# EasyEDA Pro project ProPrj_智能门禁_2025-03-14.epro

# Schematic Schematic1
Board Name: Board1; Create Date: 2025-03-06; Page Name: P1; Project Name: 智能门禁; Schematic Name: Schematic1; Update Date: 2025-03-06; Company: 嘉立创EDA; Page Size: A4; Version: V1.0
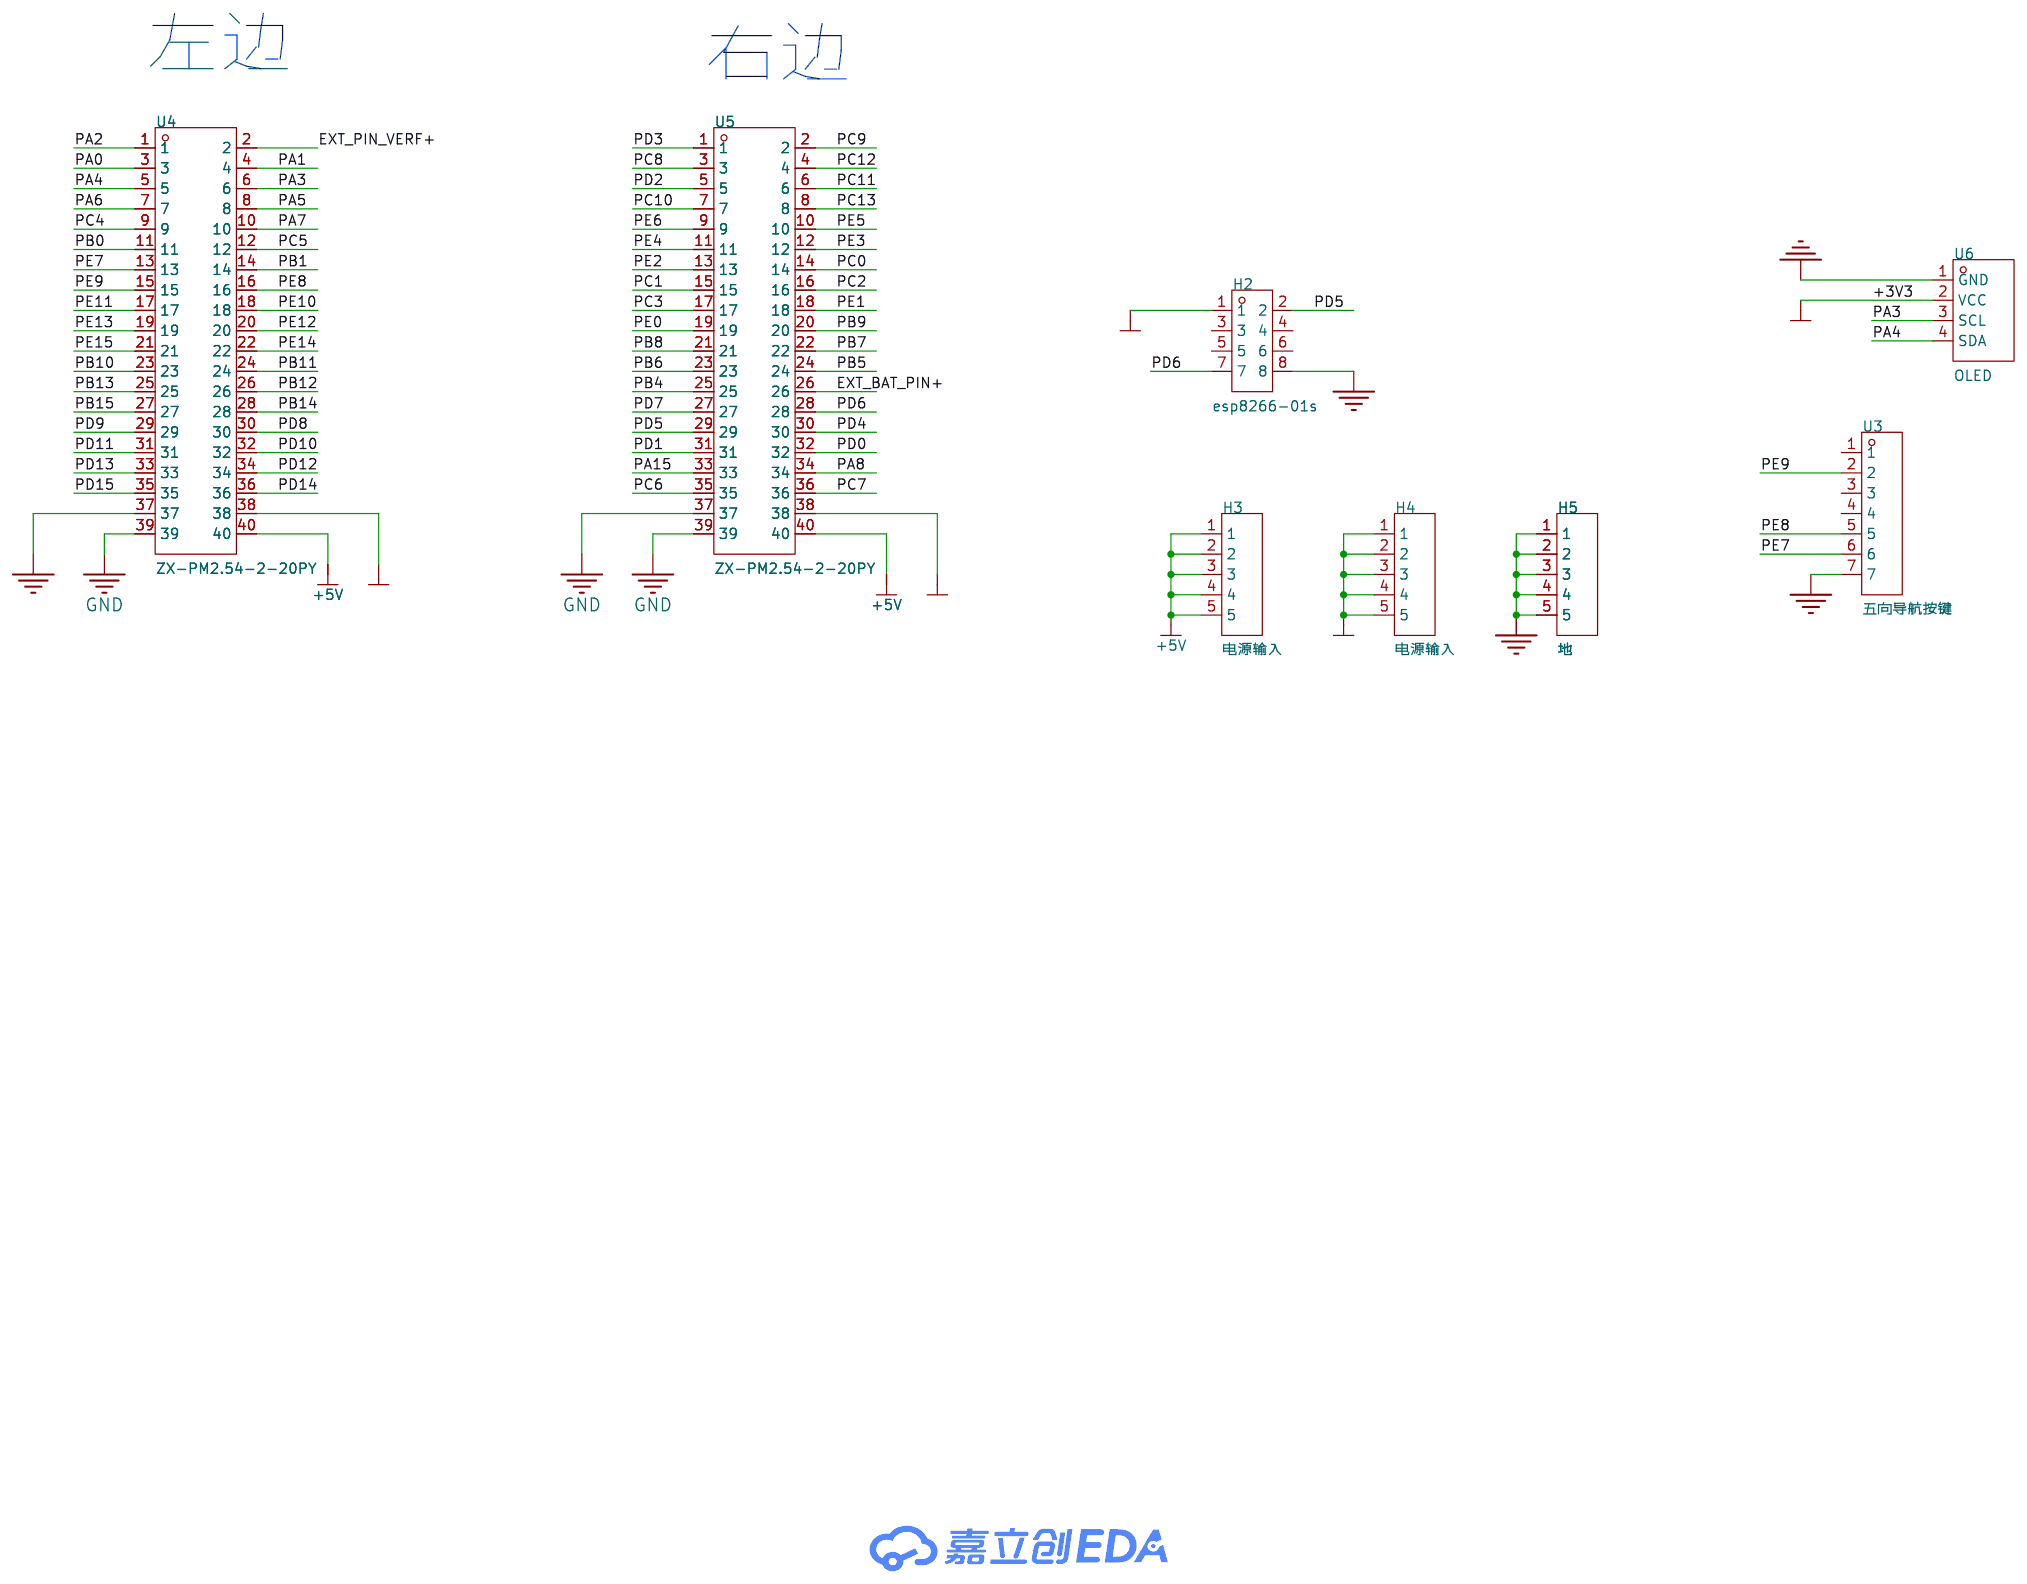
[diagram p0: schematic sheet]

## Parts
H2  esp8266-01s  [HDR-TH_8P-P2.54-V-F-R2-C4-S2.54]
H3  电源输入  [HDR-TH_5P-P2.54-V-M]
H4  电源输入  [HDR-TH_5P-P2.54-V-M]
H5  地  [HDR-TH_5P-P2.54-V-M]
U3  五向导航按键  [HDR-TH_7P-P2.54-H-F-W10.0-N]
U4  ZX-PM2.54-2-20PY  [HDR-TH_40P-P2.54-V-F-R2-C20-S2.54]
U5  ZX-PM2.54-2-20PY  [HDR-TH_40P-P2.54-V-F-R2-C20-S2.54]
U6  OLED  [OLED-TH_L27.8-W27.2-P2.54_C9900033791]

## Library data of the parts
H2 = PM254V-12-08-H85: 插孔结构:2x4P;间距:2.54mm;行距:2.54mm;圆孔/方孔:方孔;安装类型:直插;排数:双排;总孔位数:8P;额定电流:3A;额定电压:250V;插孔方向:顶部;塑高:8.5mm;工作温度范围:-40℃~+105℃;; LCSC Part Name: 间距:2.54mm 2x4P 直插; Supplier Part: C2834799; Manufacturer: XFCN(兴飞); Supplier Footprint: 插件,P=2.54mm; JLCPCB Part Class: 扩展库; Datasheet: https://atta.szlcsc.com/upload/public/pdf/source/20200309/C492399_8C441E2934FBB604A89B37A68AA45ECF.pdf; Supplier: LCSC; Holes Structure: 2x4P; Pitch: 2.54mm; Row Spacing: 2.54mm; Circular Hole / Square Hole: 方孔; Mounting Type: 直插; Number of Rows: 双排; Number of Holes: 8P; Current Rating (Max): 3A; Voltage Rating (Max): 250V; Holes Direction: 顶部; Insulation Height: 8.5mm; Operating Temperature Range: -40℃~+105℃
H3-H5 = PZ254V-11-05P: 插针结构:1x5P;间距:2.54mm;行距:-;圆针/方针:方针;安装方式:直插;排数:单排;总PIN位数:5P;额定电流:-;额定电压:-;配合针长度:6mm;塑高:2.5mm;端接针长度:3mm;触头材质:黄铜;触头镀层:-;工作温度:-40℃~+105℃;颜色:黑色;; LCSC Part Name: 1x5P 间距:2.54mm 方针 直插; Supplier Part: C492404; Manufacturer: XFCN(兴飞); Supplier Footprint: 插件,P=2.54mm; JLCPCB Part Class: 扩展库; Datasheet: https://atta.szlcsc.com/upload/public/pdf/source/20200309/C492404_E51533260F8710EFF5D4617281164C1D.pdf; Supplier: LCSC; Pin Structure: 1x5P; Pitch: 2.54mm; Circluar Pins/Square Pins: 方针; Mounting Type: 直插; Number of Rows: 单排; Number of Pins: 5P; Length of Mating Pin: 6mm; Insulation Height: 2.5mm; Length of End Connection Pin: 3mm; Contact Material: 黄铜; Operating Temperature: -40℃~+105℃; Color: 黑色
U3 = PM254-1-07-W-8.5: 插孔结构:1x7P;间距:2.54mm;行距:-;圆孔/方孔:方孔;安装类型:弯插;排数:单排;总孔位数:7P;额定电流:3A;额定电压:-;插孔方向:侧面;塑高:8.5mm;触头材质:铜合金;工作温度范围:-40℃~+105℃;焊接温度(最大值):260℃@5S;; LCSC Part Name: 1x7P 间距:2.54mm 弯插; Supplier Part: C2897389; Manufacturer: HCTL(华灿天禄); Supplier Footprint: 弯插,P=2.54mm; JLCPCB Part Class: 扩展库; Datasheet: https://atta.szlcsc.com/upload/public/pdf/source/20230609/7BA40A3D721268A082DCDEAD4C99131B.pdf; Supplier: LCSC; Holes Structure: 1x7P; Pitch: 2.54mm; Circular Hole / Square Hole: 方孔; Mounting Type: 弯插; Number of Rows: 单排; Number of Holes: 7P; Current Rating (Max): 3A; Holes Direction: 侧面; Insulation Height: 8.5mm; Contact Material: 铜合金; Operating Temperature Range: -40℃~+105℃; Soldering Temperature(Max): 260℃@5S
U4 U5 = ZX-PM2.54-2-20PY: 插孔结构:2x20P;间距:2.54mm;行距:2.54mm;圆孔/方孔:方孔;安装类型:直插;排数:双排;总孔位数:40P;额定电流:-;额定电压:1kV;插孔方向:顶部;塑高:8.5mm;触头材质:-;触头镀层:金;工作温度范围:-40℃~+105℃;焊接温度(最大值):260℃@5S;; LCSC Part Name: 2x20P 间距:2.54mm 直插; Supplier Part: C7499354; Manufacturer: Megastar(兆星); Supplier Footprint: 插件,P=2.54mm; JLCPCB Part Class: 扩展库; Datasheet: https://atta.szlcsc.com/upload/public/pdf/source/20231122/9B6D473472B386A28F854AA43527D8FA.pdf; Supplier: LCSC; Holes Structure: 2x20P; Pitch: 2.54mm; Row Spacing: 2.54mm; Circular Hole / Square Hole: 方孔; Mounting Type: 直插; Number of Rows: 双排; Number of Holes: 40P; Voltage Rating (Max): 1kV; Holes Direction: 顶部; Insulation Height: 8.5mm; Contact Plating: 金; Operating Temperature Range: -40℃~+105℃; Soldering Temperature(Max): 260℃@5S
U6 = HS96L03W2C03: 主控芯片:SSD1315;接口类型:I2C;尺寸(inch):0.96;像素分辨率:128x64;; LCSC Part Name: 0.96寸OLED显示屏窄白光IIC; Supplier Part: C5248080; Manufacturer: HS(汉昇); JLCPCB Part Class: 扩展库; Datasheet: https://atta.szlcsc.com/upload/public/pdf/source/20230627/763D01F79A90007632F098068C7C8AD9.pdf; Supplier: LCSC; Main Control Chip: SSD1315; Interface Type: I2C; Size: 0.96; Pixel Resolution: 128x64; Operating Temperature: -40℃~+70℃

## Nets
+3V3: H2.1 H4.1 H4.2 H4.3 H4.4 H4.5 U4.38 U5.38 U6.2(VCC)
+5V: H3.1 H3.2 H3.3 H3.4 H3.5 U4.40 U5.40
AGND: U4.37
GND: H2.8 H5.1 H5.2 H5.3 H5.4 H5.5 U3.7 U4.39 U5.37 U5.39 U6.1(GND)
EXT_BAT_PIN+: U5.26
EXT_PIN_VERF+: U4.2
PA0: U4.3
PA1: U4.4
PA2: U4.1
PA3: U4.6 U6.3(SCL)
PA4: U4.5 U6.4(SDA)
PA5: U4.8
PA6: U4.7
PA7: U4.10
PA8: U5.34
PA15: U5.33
PB0: U4.11
PB1: U4.14
PB4: U5.25
PB5: U5.24
PB6: U5.23
PB7: U5.22
PB8: U5.21
PB9: U5.20
PB10: U4.23
PB11: U4.24
PB12: U4.26
PB13: U4.25
PB14: U4.28
PB15: U4.27
PC0: U5.14
PC1: U5.15
PC2: U5.16
PC3: U5.17
PC4: U4.9
PC5: U4.12
PC6: U5.35
PC7: U5.36
PC8: U5.3
PC9: U5.2
PC10: U5.7
PC11: U5.6
PC12: U5.4
PC13: U5.8
PD0: U5.32
PD1: U5.31
PD2: U5.5
PD3: U5.1
PD4: U5.30
PD5: H2.2 U5.29
PD6: H2.7 U5.28
PD7: U5.27
PD8: U4.30
PD9: U4.29
PD10: U4.32
PD11: U4.31
PD12: U4.34
PD13: U4.33
PD14: U4.36
PD15: U4.35
PE0: U5.19
PE1: U5.18
PE2: U5.13
PE3: U5.12
PE4: U5.11
PE5: U5.10
PE6: U5.9
PE7: U3.6 U4.13
PE8: U3.5 U4.16
PE9: U3.2 U4.15
PE10: U4.18
PE11: U4.17
PE12: U4.20
PE13: U4.19
PE14: U4.22
PE15: U4.21

Not connected (* = marked no-connect by the designer): H2 3 4 5 6; U3 1 3 4

## Notes on the sheet
- 左边
- 右边

# Board PCB1
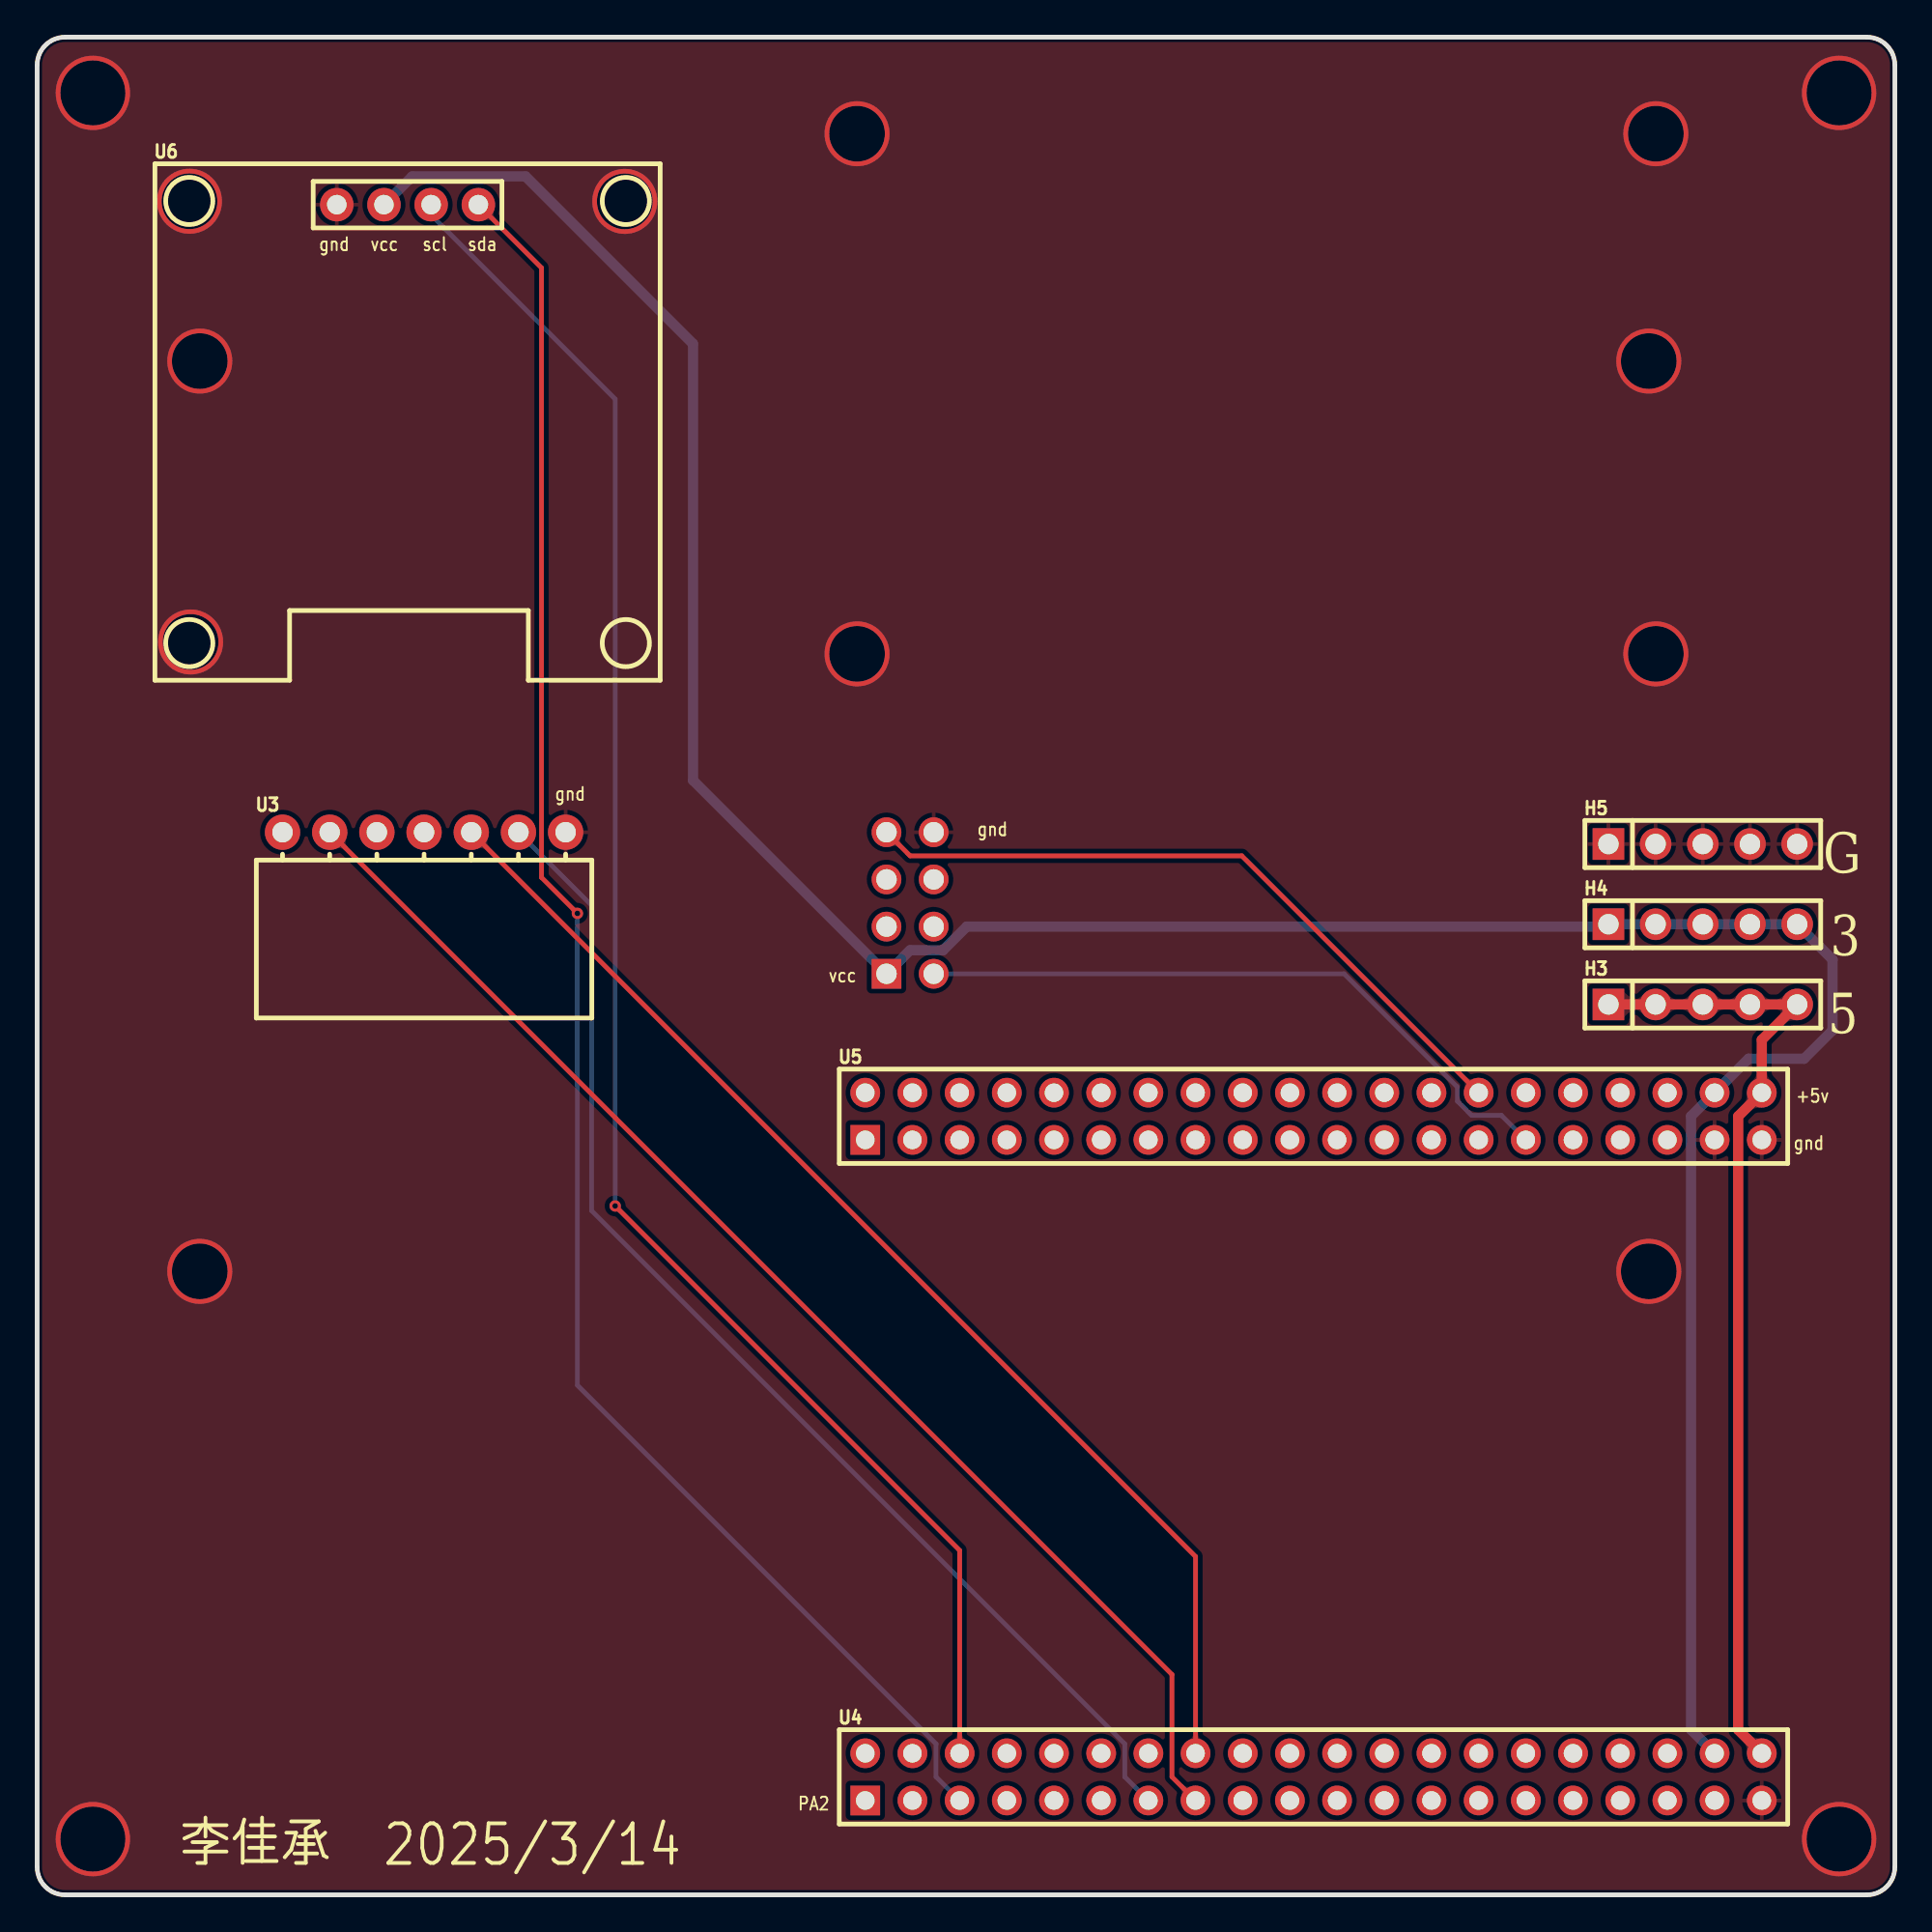
[diagram p1: board, top side]
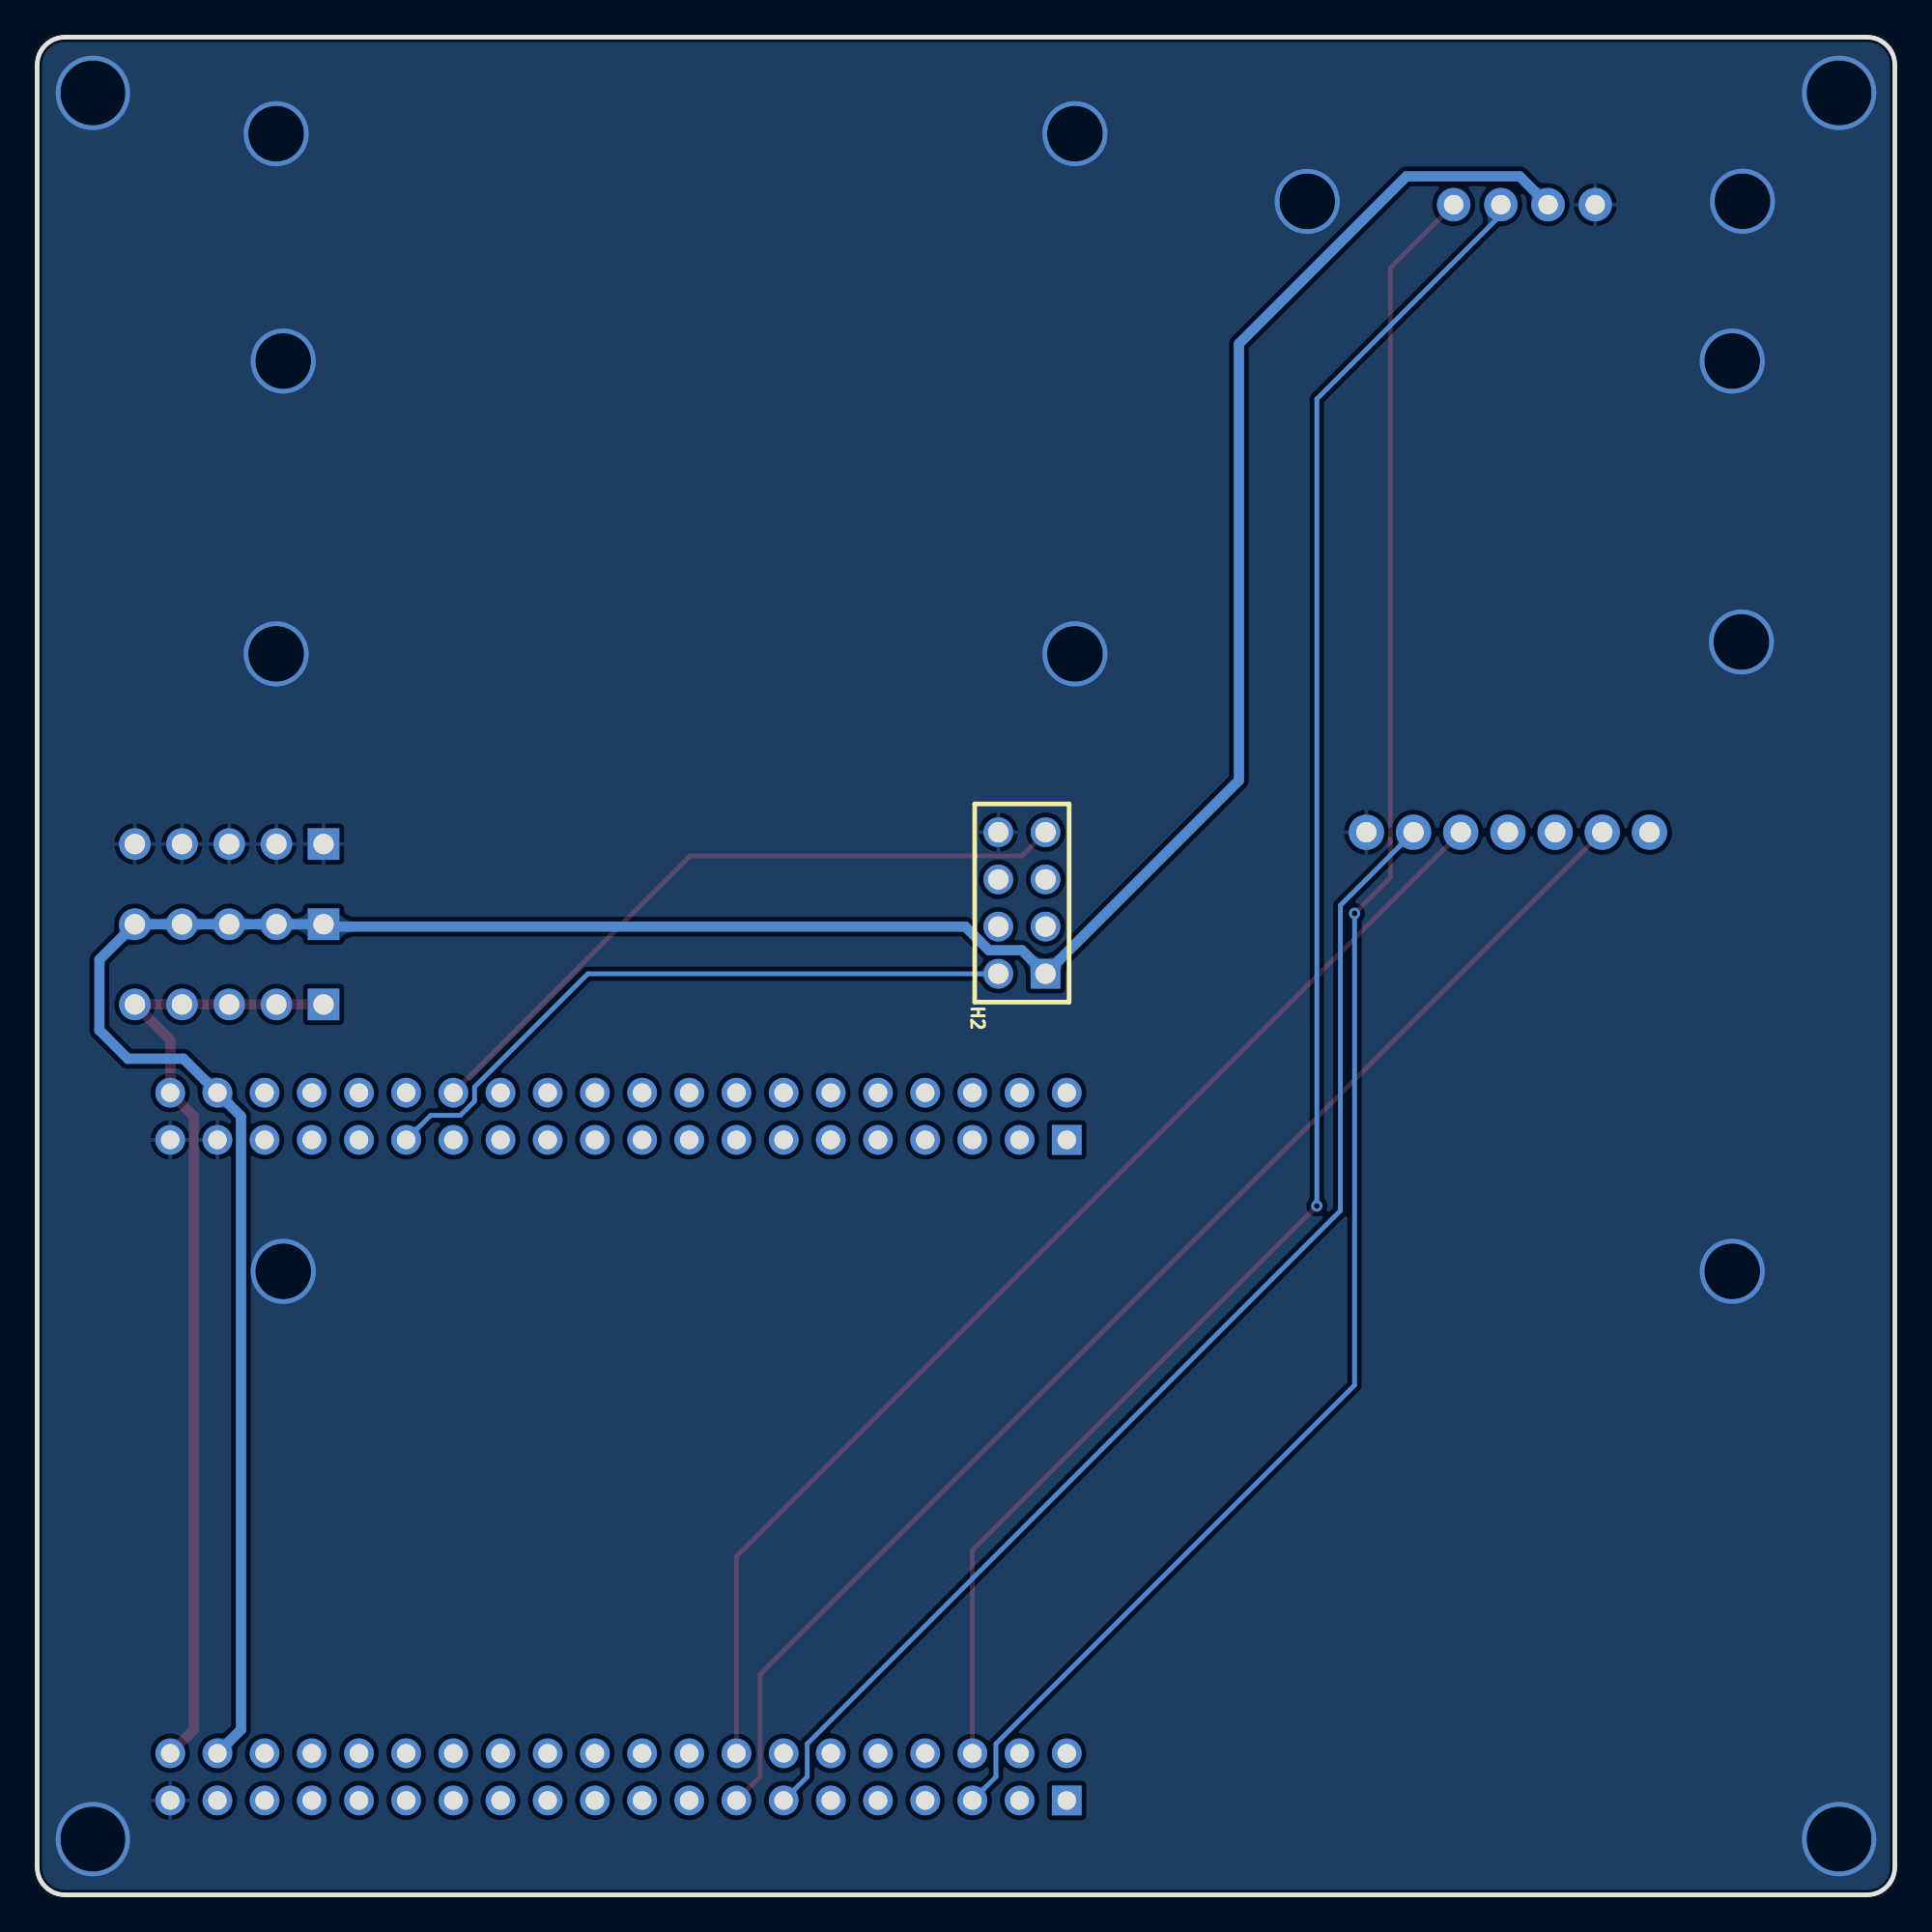
[diagram p2: board, bottom side, seen from below]

Outline 100 x 100 mm; copper layers: Top Layer, Bottom Layer. Coordinates in mm from the lower left corner of the outline.
Outline path: 0,98.5 0,1.5 arc(0.44,0.44) 1.5,0 98.5,0 arc(99.56,0.44) 100,1.5 100,98.5 arc(99.56,99.56) 98.5,100 1.5,100 arc(0.44,99.56) 0,98.5
Stack: Top Layer 0.035mm / Dielectric1 1.51mm FR4 er 4.5 / Bottom Layer 0.035mm

## Design rules (mm)
template: JLCPCB Capability(Two Layers Board)
spacing copperThickness1oz (default): track to track 0.102, other pairs 0.152 to 0.3
spacing copperThickness2oz: track to track 0.203, other pairs 0.152 to 0.3
track width copperThickness1oz (default): min 0.127, default 0.254, max 2.54
track width copperThickness2oz: min 0.203, default 0.254, max 2.54
differential pair differentialPair (default): width min 0.127, default 0.254, max 2.54; gap min 0.152, default 0.152
via viaSize (default): diameter min 0.5, default 0.61, max 10; hole min 0.3, default 0.305, max 6.3

## Placement (name value [footprint] x y rotation side)
H2  esp8266-01s  [HDR-TH_8P-P2.54-V-F-R2-C4-S2.54]  46.99 53.39 90 bottom
H3  电源输入  [HDR-TH_5P-P2.54-V-M]  89.66 47.93 0 top
H4  电源输入  [HDR-TH_5P-P2.54-V-M]  89.66 52.25 0 top
H5  地  [HDR-TH_5P-P2.54-V-M]  89.66 56.57 0 top
U3  五向导航按键  [HDR-TH_7P-P2.54-H-F-W10.0-N]  20.83 57.2 0 top
U4  ZX-PM2.54-2-20PY  [HDR-TH_40P-P2.54-V-F-R2-C20-S2.54]  68.71 6.35 0 top
U5  ZX-PM2.54-2-20PY  [HDR-TH_40P-P2.54-V-F-R2-C20-S2.54]  68.71 41.91 0 top
U6  OLED  [OLED-TH_L27.8-W27.2-P2.54_C9900033791]  19.94 90.98 0 top

## Footprints (pads in the part's own frame, mm; a bottom-side part is the same pattern mirrored in y, then rotated)
HDR-TH_5P-P2.54-V-M
  rect 1.7x1.7 hole 1.1: 1(-5.08,0)
  round 1.7 hole 1.1: 2(-2.54,0) 3(0,0) 4(2.54,0) 5(5.08,0)
HDR-TH_7P-P2.54-H-F-W10.0-N
  round 1.9 hole 1.1: 1(-7.62,0) 2(-5.08,0) 3(-2.54,0) 4(0,0) 5(2.54,0) 6(5.08,0) 7(7.62,0)
HDR-TH_8P-P2.54-V-F-R2-C4-S2.54
  rect 1.6x1.6 hole 1.1: 1(-3.81,-1.27)
  round 1.6 hole 1.1: 2(-3.81,1.27) 3(-1.27,-1.27) 4(-1.27,1.27) 5(1.27,-1.27) 6(1.27,1.27) 7(3.81,-1.27) 8(3.81,1.27)
HDR-TH_40P-P2.54-V-F-R2-C20-S2.54
  rect 1.6x1.6 hole 1: 1(-24.13,-1.27)
  round 1.6 hole 1: 2(-24.13,1.27) 3(-21.59,-1.27) 4(-21.59,1.27) 5(-19.05,-1.27) 6(-19.05,1.27) 7(-16.51,-1.27) 8(-16.51,1.27) 9(-13.97,-1.27) 10(-13.97,1.27) 11(-11.43,-1.27) 12(-11.43,1.27) 13(-8.89,-1.27) 14(-8.89,1.27) 15(-6.35,-1.27) 16(-6.35,1.27) 17(-3.81,-1.27) 18(-3.81,1.27) 19(-1.27,-1.27) 20(-1.27,1.27) 21(1.27,-1.27) 22(1.27,1.27) 23(3.81,-1.27) 24(3.81,1.27) 25(6.35,-1.27) 26(6.35,1.27) 27(8.89,-1.27) 28(8.89,1.27) 29(11.43,-1.27) 30(11.43,1.27) 31(13.97,-1.27) 32(13.97,1.27) 33(16.51,-1.27) 34(16.51,1.27) 35(19.05,-1.27) 36(19.05,1.27) 37(21.59,-1.27) 38(21.59,1.27) 39(24.13,-1.27) 40(24.13,1.27)
OLED-TH_L27.8-W27.2-P2.54_C9900033791
  round 1.8 hole 1.05: 1(-3.81,0) 2(-1.27,0) 3(1.27,0) 4(3.81,0)

## Nets
As in the schematic.

Pads without a net: H2 3 4 5 6; U3 1 3 4

## Via types
v1: diameter 3.5, hole 3, Top Layer to Bottom Layer, 11 vias
v2: diameter 4, hole 3.5, Top Layer to Bottom Layer, 4 vias
v3: diameter 0.61, hole 0.305, Top Layer to Bottom Layer, 2 vias

## Routing (per net, layer and track width the routed paths; a pad name or vN(x,y) marks a point on that pad's centre or on a via; arc(x,y) is an arc through that point)
+3V3: length 160.2
  Bottom Layer w0.55: U4.38 89.03,8.89 89.03,41.91 U5.38 92.13,45.01 95.12,45.01 96.65,46.54 96.65,50.34 H4.5 H4.4 H4.3 H4.2 H4.1 84.46,52.12 50.04,52.12 48.77,50.85 46.99,50.85 H2.1 35.31,60 35.31,83.49 26.29,92.51 20.19,92.51 U6.2
+5V: length 52.3
  Top Layer w0.55: H3.1 H3.2 H3.3 H3.4 H3.5 92.84,46.03 U5.40 91.57,41.91 91.57,8.89 U4.40
GND:
  vias: v1(8.2,91.17) v1(8.26,67.44) v1(8.75,82.56) v1(8.75,33.56) v1(31.63,91.16) v1(44.13,94.8) v1(44.13,66.8) v1(86.75,82.56) v1(86.75,33.56) v1(87.13,94.8) v1(87.13,66.8) v2(3,97) v2(3,3) v2(97,97) v2(97,3)
PA3: length 95.1
  Top Layer w0.254: v3(31.12,37.08) 49.66,18.54 U4.6
  Bottom Layer w0.254: U6.3 21.21,90.42 31.12,80.52 v3(31.12,37.08)
PA4: length 96.6
  Top Layer w0.254: v3(29.08,52.83) 27.15,54.76 27.15,87.58 U6.4
  Bottom Layer w0.254: v3(29.08,52.83) 29.08,27.43 48.39,8.13 48.39,6.35 U4.5
PD5: length 36
  Bottom Layer w0.254: H2.2 70.36,49.58 76.45,43.48 76.45,42.72 77.22,41.96 78.82,41.96 U5.29
PD6: length 37.7
  Top Layer w0.254: U5.28 64.85,55.93 46.99,55.93 45.72,57.2
PE7: length 66.2
  Bottom Layer w0.254: U4.13 58.55,6.35 58.55,8.13 29.84,36.83 29.84,53.26 U3.6
PE8: length 65.7
  Top Layer w0.254: U4.16 62.36,18.21 U3.5
PE9: length 71.4
  Top Layer w0.254: U3.2 61.09,11.86 61.09,6.35 U4.15

## Copper pours and planes (outline as drawn; the poured copper is in the pictures)
GND on Top Layer: -7.62,106.35 106.17,106.35 106.17,-4.27 -7.62,-4.27
GND on Bottom Layer: -9.27,106.22 107.19,106.22 107.19,-3 -9.27,-3

Small or netless copper shapes (teardrops, artwork), in the pictures only: 22 on Top Layer, 24 on Bottom Layer

## Text on the board
Top Silkscreen Layer: gnd | vcc | scl | sda | PA2 | +5v | 李佳承  2025/3/14 | G | 5 | 3
